# Altium schematic sheet Sheet1.SchDoc
size A4; SheetNumber: 1; SheetTotal: 1; SPICEModelCacheZGSLMGKB: <root> / <DocumentId>ZGSLMGKB</DocumentId> / <CacheFrame Number="0"> / <Model Name="ideal4w" Kind="CKT"> / <Text>*Ideal Transformer Subcircuit Parameters / *RATIO1 = turns ratio (= secondary1/primary) / *RATIO2 = turns ratio (= secondary2/primary) / *RATIO3 = turns ratio (= secondary3/primary) / * / *Ideal Transformer with four windings / *dw 18/12/00: created / *Connections: / *               Pri+ / *               | Pri- / *               | | Sec1+ / *               | | | Sec1- / *               | | | | Sec2+ / *               | | | | | Sec2- / *               | | | | | | Sec3+ / *               | | | | | | | Sec3- / *               | | | | | | | | / .SUBCKT IDEAL4W 1 2 3 4 5 6 7 8 PARAMS: RATIO1=1 RATIO2=1 RATIO3=1 / BP  1 2 I=( -I(BS1)*{RATIO1} - I(BS2)*{RATIO2} - I(BS3)*{RATIO3} ) / BS1 3 4 V=( V(1,2)*{RATIO1} ) / BS2 5 6 V=( V(1,2)*{RATIO2} ) / BS3 7 8 V=( V(1,2)*{RATIO3} ) / .ENDS IDEAL4W</Text> / </Model> / </CacheFrame> / </root>
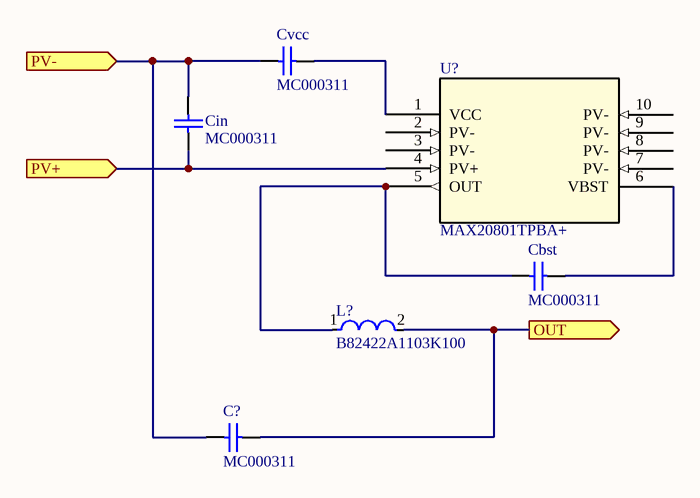
[diagram p0: Sheet1.SchDoc]

## Parts
C?  MC000311  [CAPC0603X33X15ML03T05]
Cbst  MC000311  [CAPC0603X33X15ML03T05]
Cin  MC000311  [CAPC0603X33X15ML03T05]
Cvcc  MC000311  [CAPC0603X33X15ML03T05]
L?  B82422A1103K100  [FP-B82422A-MFG]
U?  MAX20801TPBA+  [21-100119_MXM]

## Ports
OUT (out), PV+ (in), PV- (in)

## Nets
OUT: C?.2 L?.2 ; port OUT
PV+: Cin.1 U?.4(PV+) ; port PV+
PV-: C?.1 Cin.2 Cvcc.2 ; port PV-
NetCbst_1: Cbst.1 L?.1 U?.5(OUT)
NetCbst_2: Cbst.2 U?.6(VBST)
NetCvcc_1: Cvcc.1 U?.1(VCC)

Not connected (* = marked no-connect by the designer): U? 2(PV-) 3(PV-) 7(PV-) 8(PV-) 9(PV-) 10(PV-)

## Library data of the parts
C? Cbst Cin Cvcc = CMP-2010-01734-1: Manufacturer: Multicomp; Part Number: MC000311
L? = CMP-2000-05912-2: FIXED IND 10UH 180MA 1.6 OHM SMD; Tolerance: 10%; Core Material: Ferrite; Q Factor: 27; Self Resonant Frequency: 25MHz; Shielding: Unshielded; Test Frequency: 1MHz; Series Resistance: 1.6R; Radiation Hardening: No; REACH SVHC: No SVHC; Width: 0.098inch; RoHS Compliant: Yes; Case/Package: 1210; DC Current: 180mA; Package Quantity: 2000; Height - Seated (Max): 0.083inch; Rated Current-Max: 180mA; Series: SIMID; Mount: Surface Mount; Depth: 2.8mm; Resistor Type: Wirewound; Max DC Current: 180mA; Termination: SMD/SMT; Contact Plating: Tin; Height: 2.1mm; Inductance: 10uH; Case Code (Metric): 3225; Lead Free: Lead Free; Weight: 0.001764oz; Max Operating Temperature: 125°C; Length: 3.5mm; Packaging: Tape and Reel; Case Code (Imperial): 1210; Inductance Tolerance: 10%; Ratings: AEC-Q200; Number of Pins: 2; Current Rating: 180mA; Military Standard: Not; DC Resistance (DCR): 1.6R
U? = MAX20801TPBA+: No Description Available; Mfr_Name: Maxim Integrated Products; Copyright: Copyright (C) 2022 Ultra Librarian. All rights reserved.; Manufacturer_Part_Number: MAX20801TPBA+; RefDes: RefDes; Type: DEV